# Altium schematic sheet Main.SchDoc
size A4; SheetNumber: 1; SheetTotal: 4
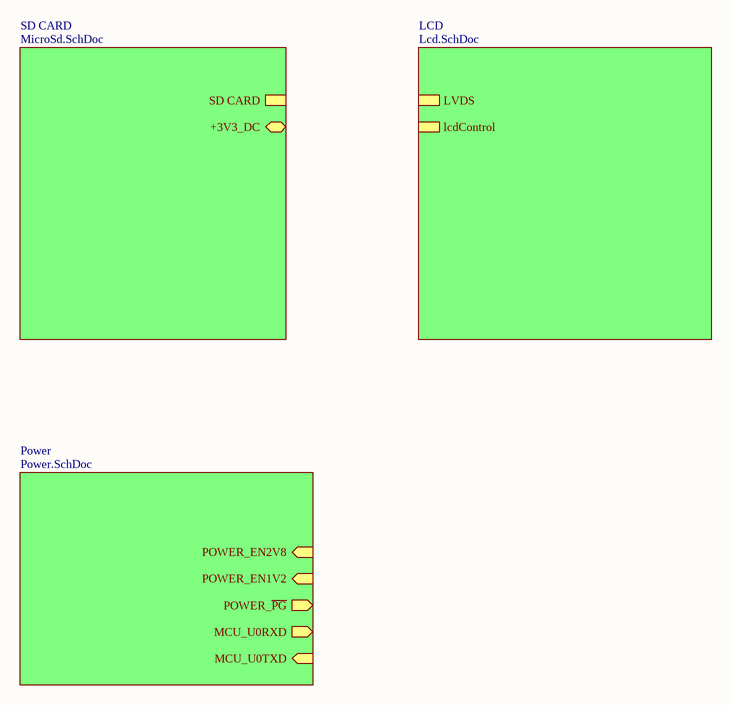
[diagram p0: Main.SchDoc]

## Sub-sheets
LCD = Lcd.SchDoc: LVDS (harness LVDS), lcdControl (harness lcdControl)
Power = Power.SchDoc: POWER_EN2V8 (in), POWER_EN1V2 (in), POWER_~{PG} (out), MCU_U0RXD (out), MCU_U0TXD (in)
SD CARD = MicroSd.SchDoc: SD CARD (harness SDIO), +3V3_DC (bidir, harness +3V3_DC)